# Altium schematic sheet LKS_DEMO_V5.0.SchDoc
size A3
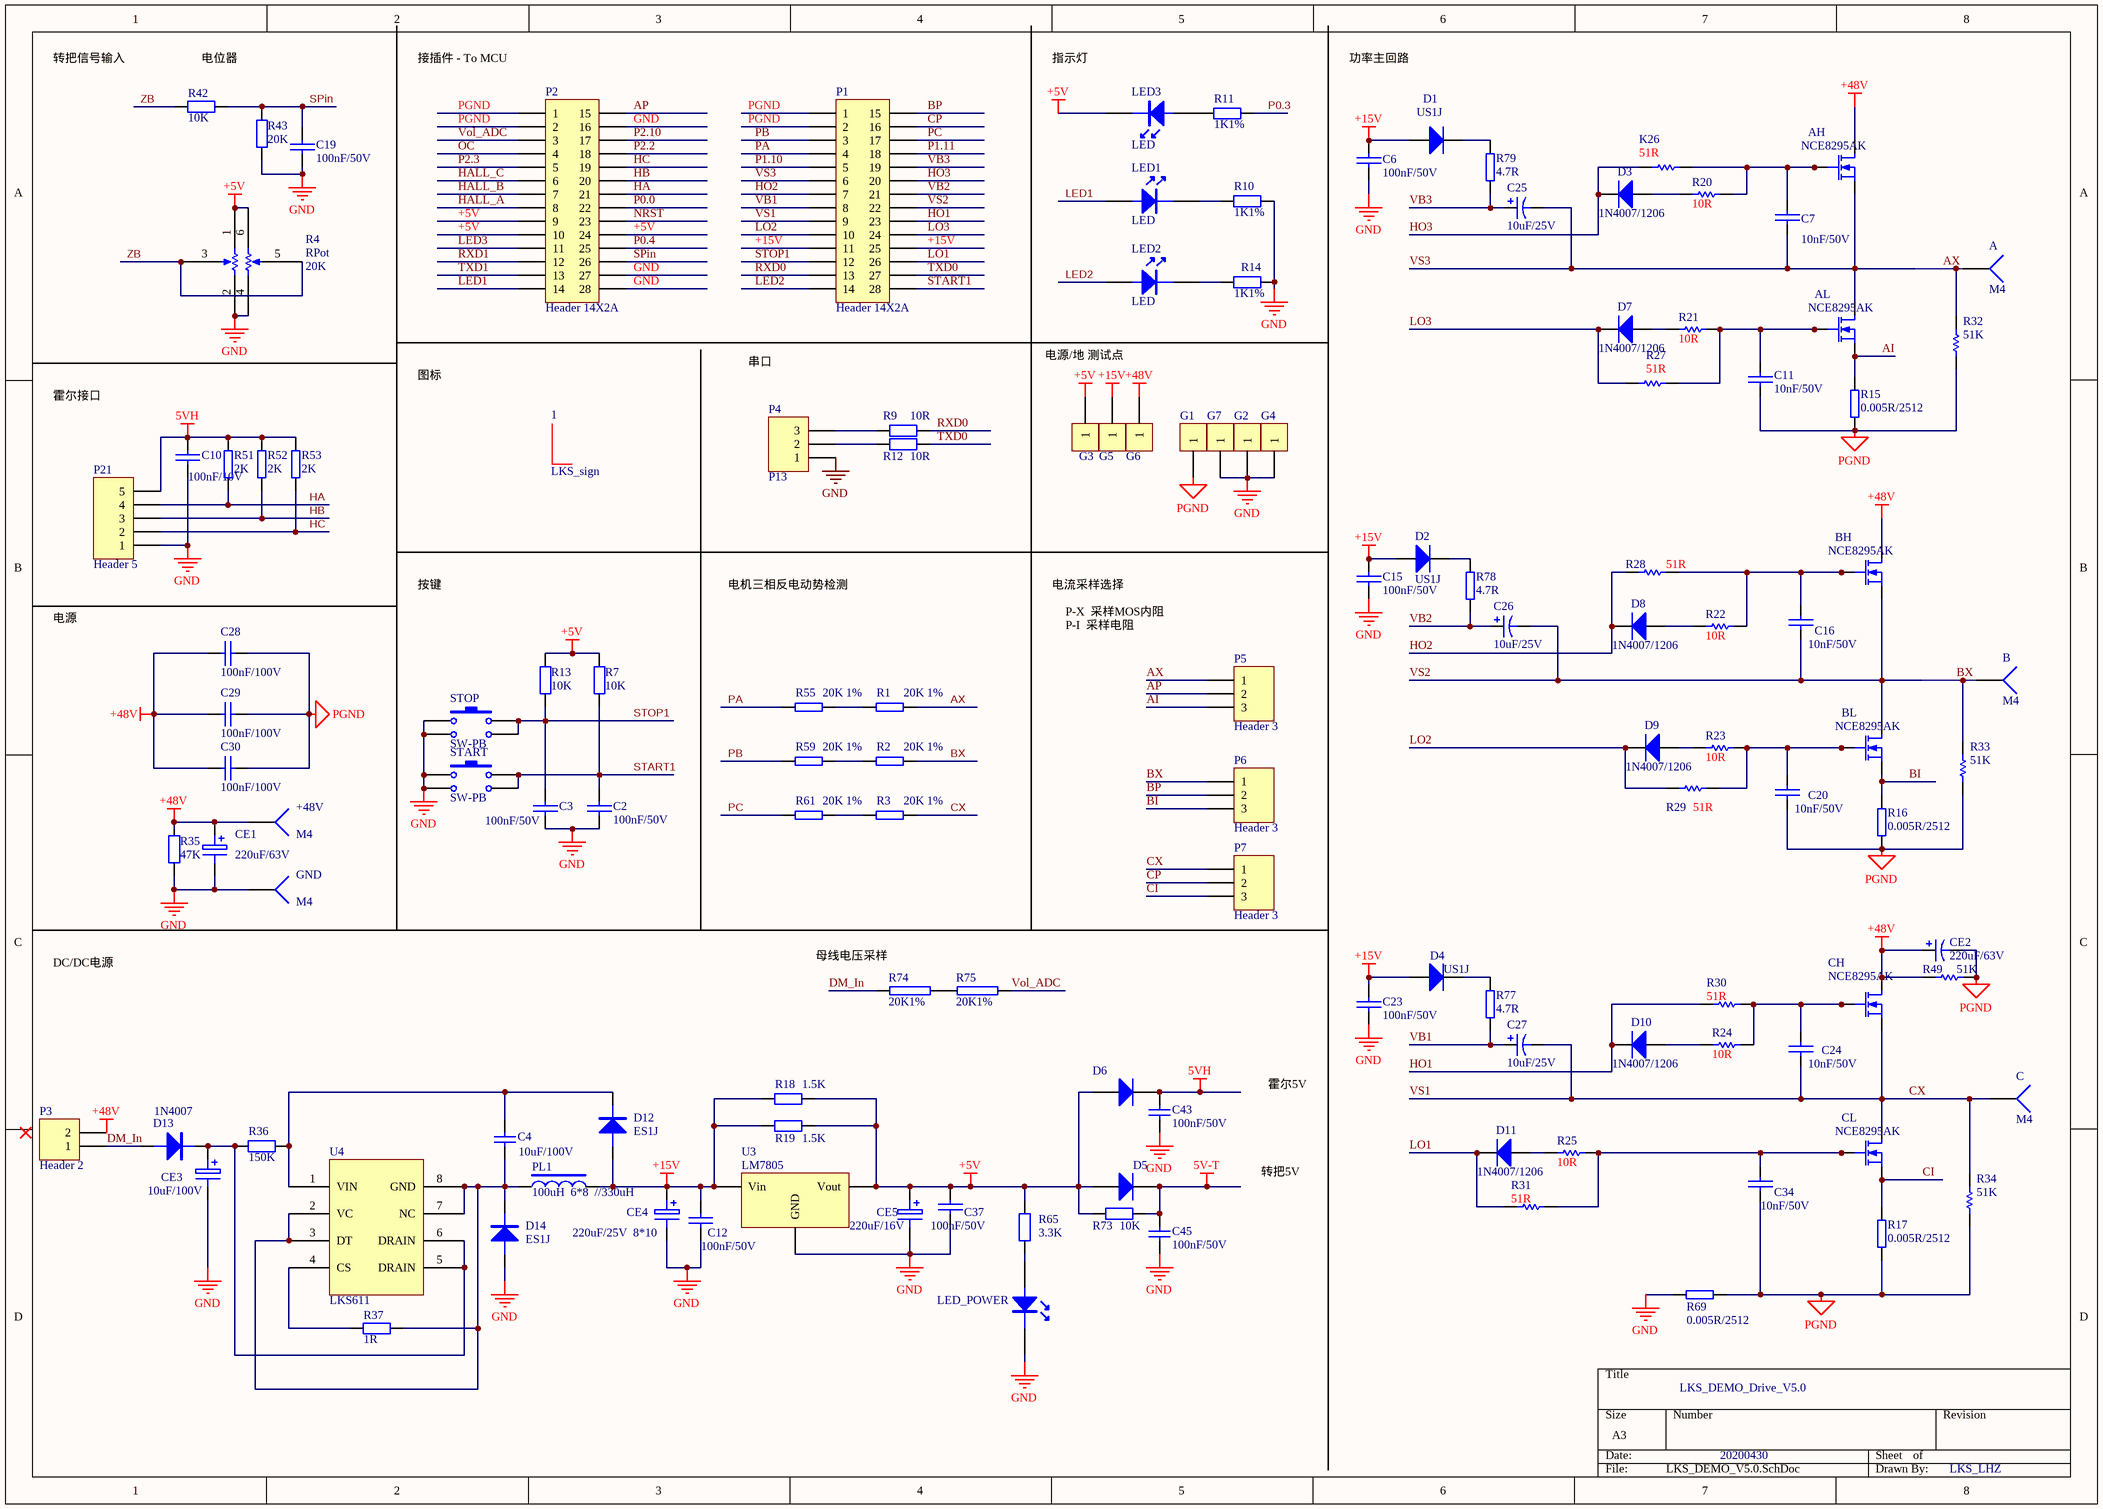
[diagram p0: LKS_DEMO_V5.0.SchDoc]

## Parts
1  LKS_sign  [LKS_LOGO2]
+48V  M4  [M4_Conector]
A  M4  [M4_Conector]
AH  NCE8295AK  [TO-252]
AL  NCE8295AK  [TO-252]
B  M4  [M4_Conector]
BH  NCE8295AK  [TO-252]
BL  NCE8295AK  [TO-252]
C  M4  [M4_Conector]
C2  100nF/50V  [0603C]
C3  100nF/50V  [0603C]
C4  10uF/100V  [1206]
C6  100nF/50V  [0603C]
C7  10nF/50V  [0603C]
C10  100nF/10V  [0603C]
C11  10nF/50V  [0603C]
C12  100nF/50V  [0603C]
C15  100nF/50V  [0603C]
C16  10nF/50V  [0603C]
C19  100nF/50V  [0603C]
C20  10nF/50V  [0603C]
C23  100nF/50V  [0603C]
C24  10nF/50V  [0603C]
C25  10uF/25V  [1206]
C26  10uF/25V  [1206]
C27  10uF/25V  [1206]
C28  100nF/100V  [0805C]
C29  100nF/100V  [0805C]
C30  100nF/100V  [0805C]
C34  10nF/50V  [0603C]
C37  100nF/50V  [0603C]
C43  100nF/50V  [0603C]
C45  100nF/50V  [0603C]
CE1  220uF/63V  [220uF/25V 12.5*12.5]
CE2  220uF/63V  [220uF/25V 12.5*12.5]
CE3  10uF/100V  [220UF/25V paster8*10]
CE4  220uF/25V  8*10  [220UF/25V paster8*10]
CE5  220uF/16V  [220UF/16V paster6.3*7.7 - duplicate]
CH  NCE8295AK  [TO-252]
CL  NCE8295AK  [TO-252]
D1  US1J  [SMA金丰]
D2  US1J  [SMA金丰]
D3  1N4007/1206  [D1206]
D4  US1J  [SMA金丰]
D5  1N4007  [D1206]  (value not drawn)
D6  1N4007  [D1206]  (value not drawn)
D7  1N4007/1206  [D1206]
D8  1N4007/1206  [D1206]
D9  1N4007/1206  [D1206]
D10  1N4007/1206  [D1206]
D11  1N4007/1206  [D1206]
D12  ES1J  [DO-214AC]
D13  1N4007  [DO-214AC]
D14  ES1J  [DO-214AC]
G1  PAD1.2  [PAD1.2]  (value not drawn)
G2  PAD1.2  [PAD1.2]  (value not drawn)
G3  PAD1.2  [PAD1.2]  (value not drawn)
G4  PAD1.2  [PAD1.2]  (value not drawn)
G5  PAD1.2  [PAD1.2]  (value not drawn)
G6  PAD1.2  [PAD1.2]  (value not drawn)
G7  PAD1.2  [PAD1.2]  (value not drawn)
GND  M4  [M4_Conector]
K26  51R  [0805R]
LED1  LED  [SOD323]
LED2  LED  [SOD323]
LED3  LED  [SOD323]
LED_POWER  LED_R  [SOD323]  (value not drawn)
P1  Header 14X2A  [HDR2X14_CEN]
P2  Header 14X2A  [HDR2X14_CEN]
P3  Header 2  [HDR1X2]
P4  P13  [2.54-XH-3A-180]
P5  Header 3  [HDR1X3]
P6  Header 3  [HDR1X3]
P7  Header 3  [HDR1X3]
P21  Header 5  [2.54-XH-5A-180]
PL1  100uH  6*8  //330uH  [L_DIP_6*8MM]
R1  20K 1%  [0805R]
R2  20K 1%  [0805R]
R3  20K 1%  [0805R]
R4  RPot  value 20K  [RK097-W]
R7  10K  [0603R]
R9  10R  [0603R]
R10  1K1%  [0603R]
R11  1K1%  [0603R]
R12  10R  [0603R]
R13  10K  [0603R]
R14  1K1%  [0603R]
R15  0.005R/2512  [2512]
R16  0.005R/2512  [2512]
R17  0.005R/2512  [2512]
R18  1.5K  [0805R]
R19  1.5K  [0805R]
R20  10R  [0805R]
R21  10R  [0805R]
R22  10R  [0805R]
R23  10R  [0805R]
R24  10R  [0805R]
R25  10R  [0805R]
R27  51R  [0805R]
R28  51R  [0805R]
R29  51R  [0805R]
R30  51R  [0805R]
R31  51R  [0805R]
R32  51K  [0805R]
R33  51K  [0805R]
R34  51K  [0805R]
R35  47K  [1206R]
R36  150K  [0805R]
R37  1R  [1206]
R42  10K  [0603R]
R43  20K  [0603R]
R49  51K  [0805R]
R51  2K  [0603R]
R52  2K  [0603R]
R53  2K  [0603R]
R55  20K 1%  [0805R]
R59  20K 1%  [0805R]
R61  20K 1%  [0805R]
R65  3.3K  [0603R]
R69  0.005R/2512  [2512]
R73  10K  [0603R]
R74  20K1%  [0603R]
R75  20K1%  [0603R]
R77  4.7R  [0805r]
R78  4.7R  [0805r]
R79  4.7R  [0805r]
START  SW-PB  [SW-PB  12*12]
STOP  SW-PB  [SW-PB  12*12]
U3  LM7805  [SOT-89]
U4  LKS611

## Nets
5V-T: C45.2 D5.2(K) R73.2
5VH: C10.1 C43.2 D6.2(K) P21.5 R51.2 R52.2 R53.2
+5V: C37.2 CE5.1 D5.1(A) D6.1(A) G3.1 LED3.2(K) P2.9 P2.10 P2.24 R4.1(TOP) R4.6(TOP) R7.1 R13.2 R18.2 R19.2 R65.1 R73.1 U3.1(Vout)
+15V: C6.2 C12.1 C15.2 C23.2 CE4.1 D1.1(A) D2.1(A) D4.1(A) D12.1 G5.1 P1.11 P1.25 PL1.1 R18.1 R19.1 U3.3(Vin)
+48V: +48V.1 AH.2(D) BH.2(D) C28.2 C29.2 C30.2 CE1.1 CE2.1 CH.2(D) G6.1 P3.2 R35.1 R49.1
GND: C2.1 C3.2 C6.1 C10.2 C12.2 C15.1 C19.1 C23.1 C37.1 C43.1 C45.1 CE1.2 CE3.2 CE4.2 CE5.2 D14.1 G2.1 G4.1 G7.1 GND.1 LED_POWER.2(K) P2.16 P2.27 P2.28 P4.1 P21.1 R4.2(TAP) R4.4(BOT) R10.2 R14.2 R35.2 R43.1 R69.2 START.1 START.3 STOP.1 STOP.3 U3.2(GND)
PGND: C11.2 C20.2 C28.1 C29.1 C30.1 C34.2 CE2.2 G1.1 P1.1 P1.2 P2.1 P2.2 R15.2 R16.1 R17.2 R32.1 R33.1 R34.1 R49.2 R69.1
AI: AL.3(S) P5.3 R15.1
AP: P2.15 P5.2
AX: A.1 AH.3(S) AL.2(D) C7.2 C25.2 P1.6 P5.1 R1.2 R32.2  [also labelled VS3]
BI: BL.3(S) P6.3 R16.2
BP: P1.15 P6.2
BX: B.1 BH.3(S) BL.2(D) C16.2 C26.2 P1.22 P6.1 R2.2 R33.2  [also labelled VS2]
CI: CL.3(S) P7.3 R17.1
CP: P1.16 P7.2
CX: C.1 C24.2 C27.2 CH.3(S) CL.2(D) P1.9 P7.1 R3.2 R34.2  [also labelled VS1]
DM_In: D13.1 P3.1 R74.1
HA: P2.21 P21.4 R51.1
HALL_A: P2.8
HALL_B: P2.7
HALL_C: P2.6
HB: P2.20 P21.3 R52.1
HC: P2.19 P21.2 R53.1
HO1: D10.2(K) P1.23 R30.1
HO2: D8.2(K) P1.7 R28.1
HO3: D3.2(K) K26.1 P1.20
LED1: LED1.1(A) P2.14
LED2: LED2.1(A) P1.14
LED3: P2.11
LO1: D11.2(K) P1.26 R31.1
LO2: D9.2(K) P1.10 R29.1
LO3: D7.2(K) P1.24 R27.1
NRST: P2.23
OC: P2.4
P0.0: P2.22
P0.3: R11.2
P0.4: P2.25
P1.10: P1.5
P1.11: P1.18
P2.2: P2.18
P2.3: P2.5
P2.10: P2.17
PA: P1.4 R55.1
PB: P1.3 R59.1
PC: P1.17 R61.1
RXD0: P1.13 R9.1
RXD1: P2.12
SPin: C19.2 P2.26 R42.2 R43.2
START1: C2.2 P1.28 R7.2 START.2 START.4
STOP1: C3.1 P1.12 R13.1 STOP.2 STOP.4
TXD0: P1.27 R12.2
TXD1: P2.13
VB1: C27.1 P1.8 R77.1
VB2: C26.1 P1.21 R78.1
VB3: C25.1 P1.19 R79.1
Vol_ADC: P2.3 R75.2
ZB: R4.3(BOT) R4.5(TAP) R42.1
NetAH_1: AH.1(G) C7.1 K26.2 R20.1
NetAL_1: AL.1(G) C11.1 R21.1 R27.2
NetBH_1: BH.1(G) C16.1 R22.1 R28.2
NetBL_1: BL.1(G) C20.1 R23.1 R29.2
NetC4_1: C4.1 D12.2 R36.1 U4.1(VIN)
NetC4_2: C4.2 D14.2 PL1.2 R37.2 U4.2(VC) U4.3(DT) U4.7(NC) U4.8(GND)
NetC24_1: C24.1 CH.1(G) R24.1 R30.2
NetC34_1: C34.1 CL.1(G) R25.1 R31.2
NetCE3_1: CE3.1 D13.2 R36.2 U4.5(DRAIN) U4.6(DRAIN)
NetD1_2: D1.2(K) R79.2
NetD2_2: D2.2(K) R78.2
NetD3_1: D3.1(A) R20.2
NetD4_2: D4.2(K) R77.2
NetD7_1: D7.1(A) R21.2
NetD8_1: D8.1(A) R22.2
NetD9_1: D9.1(A) R23.2
NetD10_1: D10.1(A) R24.2
NetD11_1: D11.1(A) R25.2
NetLED1_2: LED1.2(K) R10.1
NetLED2_2: LED2.2(K) R14.1
NetLED3_1: LED3.1(A) R11.1
NetLED_POWER_1: LED_POWER.1(A) R65.2
NetP4_2: P4.2 R12.1
NetP4_3: P4.3 R9.2
NetR1_1: R1.1 R55.2
NetR2_1: R2.1 R59.2
NetR3_1: R3.1 R61.2
NetR37_1: R37.1 U4.4(CS)
NetR74_2: R74.2 R75.1

## Notes on the sheet
- 转把信号输入
- (near R42) 电位器
- 接插件 - To MCU
- 指示灯
- 功率主回路
- 图标
- 串口
- 电源/地 测试点
- 霍尔接口
- 按键
- 电机三相反电动势检测
- 电流采样选择
- 电源
- P-X  采样MOS内阻
- P-I  采样电阻
- DC/DC电源
- (near R74) 母线电压采样
- LKS_DEMO_Drive_V5.0
- 20200430
- LKS_LHZ
- Labels drawn without touching a wire or pin: 转把5V, 霍尔5V

## Library data of the parts
+48V A B C GND = Socket: LatestRevisionDate: 17-Jul-2002; LatestRevisionNote: Re-released for DXP Platform.; Publisher: Altium Limited
AH AL BH BL CH CL = MOS
C2 C3 C7 C10-C12 C16 C20 C24 C28-C30 C34 = CAP: Capacitor
C4 = Cap: Capacitor; Published: 8-Jun-2000; LatestRevisionDate: 17-Jul-2002; LatestRevisionNote: Re-released for DXP Platform.; PackageReference: RAD-0.3; Publisher: Altium Limited; PackageDescription: Radial Cap, Thru-Hole; 2 Leads; 0.3 in Pin Spacing; Value: 10uF/100V
C6 C15 C19 C23 C37 = C: Capacitor
C25-C27 = Cap Pol1: Polarized Capacitor (Radial); Value: 47uF/50V; Published: 8-Jun-2000; LatestRevisionDate: 17-Jul-2002; LatestRevisionNote: Re-released for DXP Platform.; PackageReference: RB7.6-15; Publisher: Altium Limited; = Value: 47uF/50V
C43 C45 = Cap: Capacitor; Value: 104; Published: 8-Jun-2000; LatestRevisionDate: 17-Jul-2002; LatestRevisionNote: Re-released for DXP Platform.; PackageReference: RAD-0.3; Publisher: Altium Limited; PackageDescription: Radial Cap, Thru-Hole; 2 Leads; 0.3 in Pin Spacing
CE1 CE3-CE5 = CD: Electrolytic Capacitor
CE2 = Cap Pol1: Polarized Capacitor (Radial); Value: 1uF; Published: 8-Jun-2000; LatestRevisionDate: 17-Jul-2002; LatestRevisionNote: Re-released for DXP Platform.; PackageReference: RB7.6-15; Publisher: Altium Limited
D1-D4 D7-D11 = Diode: Default Diode; Published: 8-Jun-2000; LatestRevisionDate: 17-Jul-2002; LatestRevisionNote: Re-released for DXP Platform.; PackageDocument: Sep-1996; PackageReference: SMC; Publisher: Altium Limited; Code_JEDEC: DO-214-AB
D5 D6 = Diode 1N4007: 1 Amp General Purpose Rectifier; Published: 8-Jun-2000; LatestRevisionDate: 17-Jul-2002; LatestRevisionNote: Re-released for DXP Platform.; DatasheetVersion: 1998; PackageVersion: Aug-1999; PackageReference: DO-41; Publisher: Altium Limited; PackageDescription: Diode, Axial; Body 5.2 x 2.7 mm (LxDia. max), Lead Dia. 0.86 mm (max); Code_JEDEC: DO-204-AL; ComponentLink1Description: Manufacturer Link; ComponentLink1URL: http://www.fairchildsemi.com/; ComponentLink2Description: Datasheet; ComponentLink2URL: http://www.fairchildsemi.com/ds/1N%2F1N4001.pdf
D12-D14 = D: Diode
G1-G7 = CON1: Connector
K26 R20-R25 R27-R31 = Res1: Resistor; Value: 150; Published: 8-Jun-2000; LatestRevisionDate: 17-Jul-2002; LatestRevisionNote: Re-released for DXP Platform.; PackageReference: AXIAL-0.3; Publisher: Altium Limited; = Value: 150
LED_POWER = LED
P1 P2 = Header 14X2A: Header, 14-Pin, Dual row; LatestRevisionDate: 17-Jul-2002; LatestRevisionNote: Re-released for DXP Platform.; Publisher: Altium Limited
P3 = Header 2: Header, 2-Pin; LatestRevisionDate: 17-Jul-2002; LatestRevisionNote: Re-released for DXP Platform.; Publisher: Altium Limited
P4-P7 = Header 3: Header, 3-Pin; LatestRevisionDate: 17-Jul-2002; LatestRevisionNote: Re-released for DXP Platform.; Publisher: Altium Limited
P21 = Header 5: Header, 5-Pin; LatestRevisionDate: 17-Jul-2002; LatestRevisionNote: Re-released for DXP Platform.; Publisher: Altium Limited
PL1 = L
R1-R3 R51-R53 R55 R59 R61 = RES/1
R4 = RPot: Potentiometer; Sim Note: Enter the Resistance value and the set point into parameter fields.; Set Position: 0.5; Published: 8-Jun-2000; LatestRevisionDate: 17-Jul-2002; LatestRevisionNote: Re-released for DXP Platform.; PackageReference: VR5; Publisher: Altium Limited; PackageDescription: Variable Resistor, Thru-Hole; 3 Leads
R7 R9 R13 R36 R37 R73 = Res2: Resistor; Published: 8-Jun-2000; LatestRevisionDate: 17-Jul-2002; LatestRevisionNote: Re-released for DXP Platform.; Publisher: Altium Limited
  R7 R13: PackageReference: AXIAL-0.4; Value: 10K
  R9: PackageReference: 0603R
  R36: PackageReference: AXIAL-0.4; PackageDescription: Axial Device, Thru-Hole; 2 Leads; 0.4 in Pin Spacing; Value: 150K
  R37: PackageReference: AXIAL-0.4; PackageDescription: Axial Device, Thru-Hole; 2 Leads; 0.4 in Pin Spacing; Value: 1R
  R73: PackageReference: AXIAL-0.4; PackageDescription: Axial Device, Thru-Hole; 2 Leads; 0.4 in Pin Spacing; Value: 10K
R10 R11 R14 = Res2: Resistor; Value: 10K; Published: 8-Jun-2000; LatestRevisionDate: 17-Jul-2002; LatestRevisionNote: Re-released for DXP Platform.; PackageReference: AXIAL-0.4; Publisher: Altium Limited
R12 = Res2: Resistor; Value: 100R; Published: 8-Jun-2000; LatestRevisionDate: 17-Jul-2002; LatestRevisionNote: Re-released for DXP Platform.; PackageReference: 0603R; Publisher: Altium Limited
R15-R17 R69 R77-R79 = RES2短
R18 R19 R35 R42 R43 = Res: Resistor; Value: K; Published: 8-Jun-2000; LatestRevisionDate: 17-Jul-2002; LatestRevisionNote: Re-released for DXP Platform.; PackageReference: AXIAL-0.4; Publisher: Altium Limited; PackageDescription: Axial Device, Thru-Hole; 2 Leads; 0.4 in Pin Spacing
R32-R34 = Res1: Resistor; Value: 10K; Published: 8-Jun-2000; LatestRevisionDate: 17-Jul-2002; LatestRevisionNote: Re-released for DXP Platform.; PackageReference: AXIAL-0.3; Publisher: Altium Limited; = Value: 10K
R49 = Res1: Resistor; Value: 47K; Published: 8-Jun-2000; LatestRevisionDate: 17-Jul-2002; LatestRevisionNote: Re-released for DXP Platform.; PackageReference: AXIAL-0.3; Publisher: Altium Limited; = Value: 47K
R65 = Res2: Resistor; Value: 510R; Published: 8-Jun-2000; LatestRevisionDate: 17-Jul-2002; LatestRevisionNote: Re-released for DXP Platform.; PackageReference: 0603R; Publisher: Altium Limited; PackageDescription: Axial Device, Thru-Hole; 2 Leads; 0.4 in Pin Spacing
R74 R75 = R
START STOP = SW-PB: Switch; Published: 24-Mar-1999; LatestRevisionDate: 17-Jul-2002; LatestRevisionNote: Re-released for DXP Platform.; PackageReference: SPST-2; Publisher: Altium Limited; PackageDescription: Switch; 2 Leads
U3 = VOL-78